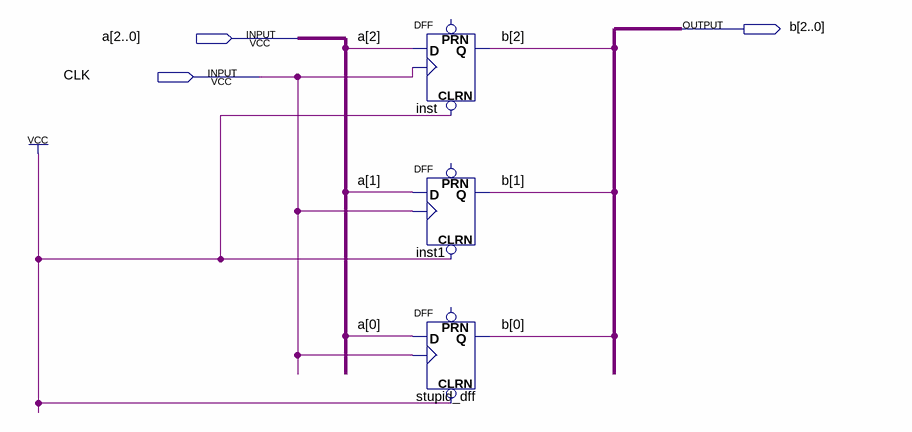
[diagram p0: schematic sheet]
// Quartus schematic 3_bit_register.bdf as structural Verilog: 3 symbols, 3 pins
module \3_bit_register  (
  input  [2:0] a,
  input  CLK,
  output [2:0] b
);

  DFF inst (.CLRN(1'b1), .CLK(CLK), .D(a[2]), .Q(b[2]));  // open: PRN
  DFF inst1 (.CLRN(1'b1), .CLK(CLK), .D(a[1]), .Q(b[1]));  // open: PRN
  DFF stupid_dff (.CLRN(1'b1), .CLK(CLK), .D(a[0]), .Q(b[0]));  // open: PRN
endmodule
